# Altium schematic sheet TESTER_REMOTE_STEPPER_DRIVER_02.SchDoc: TESTER_REMOTE_CONTROLLER
size A4; CheckedBy: A_MOALLEMI; DrawnBy: A_RAJABI; SheetNumber: 3; SheetTotal: 3
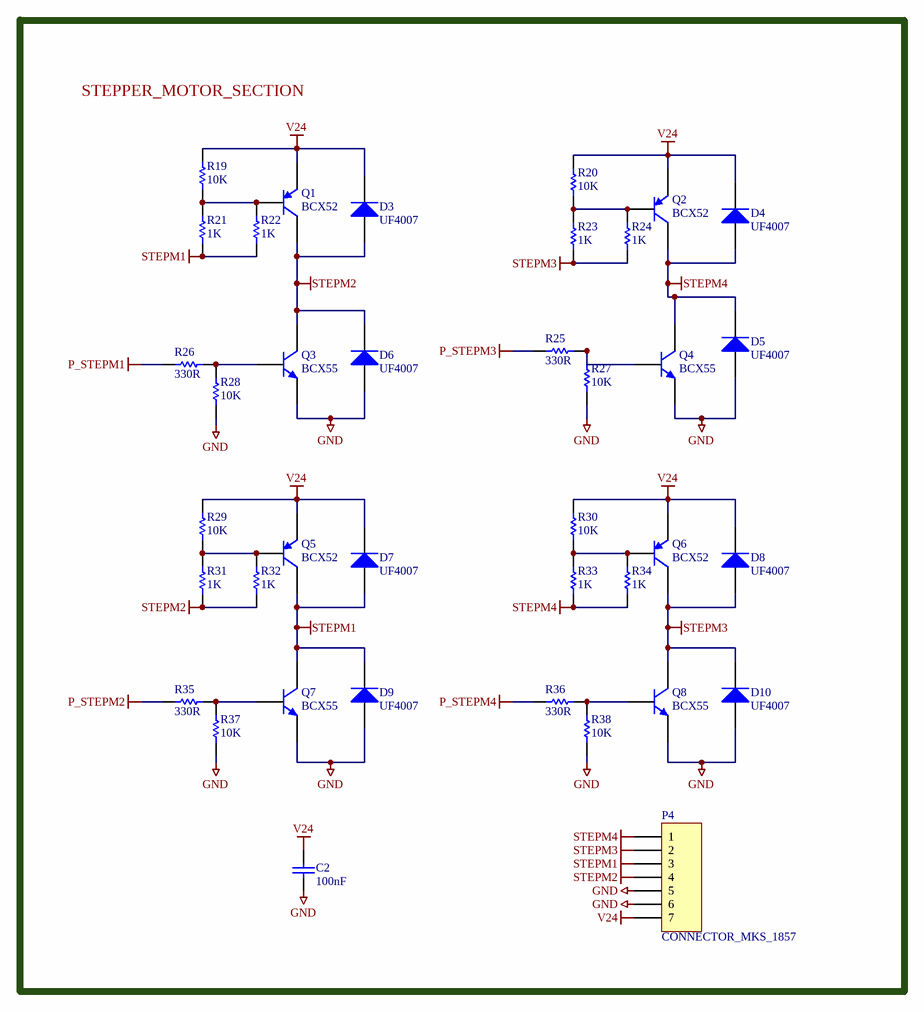
[diagram p0: TESTER_REMOTE_STEPPER_DRIVER_02.SchDoc]

## Parts
C2  100nF  [SMD 0805]
D3  UF4007  [SMD SMA]
D4  UF4007  [SMD SMA]
D5  UF4007  [SMD SMA]
D6  UF4007  [SMD SMA]
D7  UF4007  [SMD SMA]
D8  UF4007  [SMD SMA]
D9  UF4007  [SMD SMA]
D10  UF4007  [SMD SMA]
P4  CONNECTOR_MKS_1857  [CON MKS1857 7]
Q1  BCX52  [SMD SOT89 TRANSISTOR]
Q2  BCX52  [SMD SOT89 TRANSISTOR]
Q3  BCX55  [SMD SOT89 TRANSISTOR]
Q4  BCX55  [SMD SOT89 TRANSISTOR]
Q5  BCX52  [SMD SOT89 TRANSISTOR]
Q6  BCX52  [SMD SOT89 TRANSISTOR]
Q7  BCX55  [SMD SOT89 TRANSISTOR]
Q8  BCX55  [SMD SOT89 TRANSISTOR]
R19  10K  [SMD 1206]
R20  10K  [SMD 1206]
R21  1K  [SMD 1206]
R22  1K  [SMD 1206]
R23  1K  [SMD 1206]
R24  1K  [SMD 1206]
R25  330R  [SMD 1206]
R26  330R  [SMD 1206]
R27  10K  [SMD 0805]
R28  10K  [SMD 0805]
R29  10K  [SMD 1206]
R30  10K  [SMD 1206]
R31  1K  [SMD 1206]
R32  1K  [SMD 1206]
R33  1K  [SMD 1206]
R34  1K  [SMD 1206]
R35  330R  [SMD 1206]
R36  330R  [SMD 1206]
R37  10K  [SMD 0805]
R38  10K  [SMD 0805]

## Nets
GND: C2.2 D5.1 D6.1 D9.1 D10.1 P4.5 P4.6 Q3.2(E) Q4.2(E) Q7.2(E) Q8.2(E) R27.1 R28.1 R37.1 R38.1
P_STEPM1: R26.2
P_STEPM2: R35.2
P_STEPM3: R25.2
P_STEPM4: R36.2
STEPM1: D7.1 D9.2 P4.3 Q5.3(C) Q7.3(C) R21.1 R22.1
STEPM2: D3.1 D6.2 P4.4 Q1.3(C) Q3.3(C) R31.1 R32.1
STEPM3: D8.1 D10.2 P4.2 Q6.3(C) Q8.3(C) R23.1 R24.1
STEPM4: D4.1 D5.2 P4.1 Q2.3(C) Q4.3(C) R33.1 R34.1
V24: C2.1 D3.2 D4.2 D7.2 D8.2 P4.7 Q1.2(E) Q2.2(E) Q5.2(E) Q6.2(E) R19.2 R20.2 R29.2 R30.2
NetQ1_1: Q1.1(B) R19.1 R21.2 R22.2
NetQ2_1: Q2.1(B) R20.1 R23.2 R24.2
NetQ3_1: Q3.1(B) R26.1 R28.2
NetQ4_1: Q4.1(B) R25.1 R27.2
NetQ5_1: Q5.1(B) R29.1 R31.2 R32.2
NetQ6_1: Q6.1(B) R30.1 R33.2 R34.2
NetQ7_1: Q7.1(B) R35.1 R37.2
NetQ8_1: Q8.1(B) R36.1 R38.2

## Notes on the sheet
- STEPPER_MOTOR_SECTION
- DrawnBy:
- ProjectName:
- Date:
- CheckedBy:
- Size:
- A4
- File:
- Sheet
- of

## Library data of the parts
C2 = CAP: Capacitor; Published: 8-Jun-2000; LatestRevisionDate: 17-Jul-2002; LatestRevisionNote: Re-released for DXP Platform.; PackageReference: RAD-0.3; Publisher: Altium Limited; PackageDescription: Radial Cap, Thru-Hole; 2 Leads; 0.3 in Pin Spacing
D3-D10 = DIODE: Typical Diode
P4 = CONNECTOR 7: Header, 7-Pin; LatestRevisionDate: 17-Jul-2002; LatestRevisionNote: Re-released for DXP Platform.; Publisher: Altium Limited
Q1 Q2 Q5 Q6 = Q PNP: PNP Bipolar Transistor; Published: 8-Jun-2000; LatestRevisionDate: 29-May-2009; LatestRevisionNote: IPC-7351 Footprint Added.; PackageVersion: Aug-1999; PackageReference: SOT-23B; Publisher: Altium Limited; PackageDescription: 3-Pin SOT-23 Package 0.95 mm Pitch, 2.4 mm Lead Span
Q3 Q4 Q7 Q8 = Q NPN: NPN Bipolar Transistor; Published: 8-Jun-2000; LatestRevisionDate: 17-Jul-2002; LatestRevisionNote: Re-released for DXP Platform.; PackageReference: TO-226-AA; Publisher: Altium Limited; PackageDescription: TO, Flat Index; 3 In-Line, Axial Leads; Body Dia. 4.8mm; Leads 0.55 x 0.51 mm (max); Code_JEDEC: TO-226-AA
R19-R38 = RES: Resistor